# Altium schematic sheet Sheet1.SchDoc
size A4
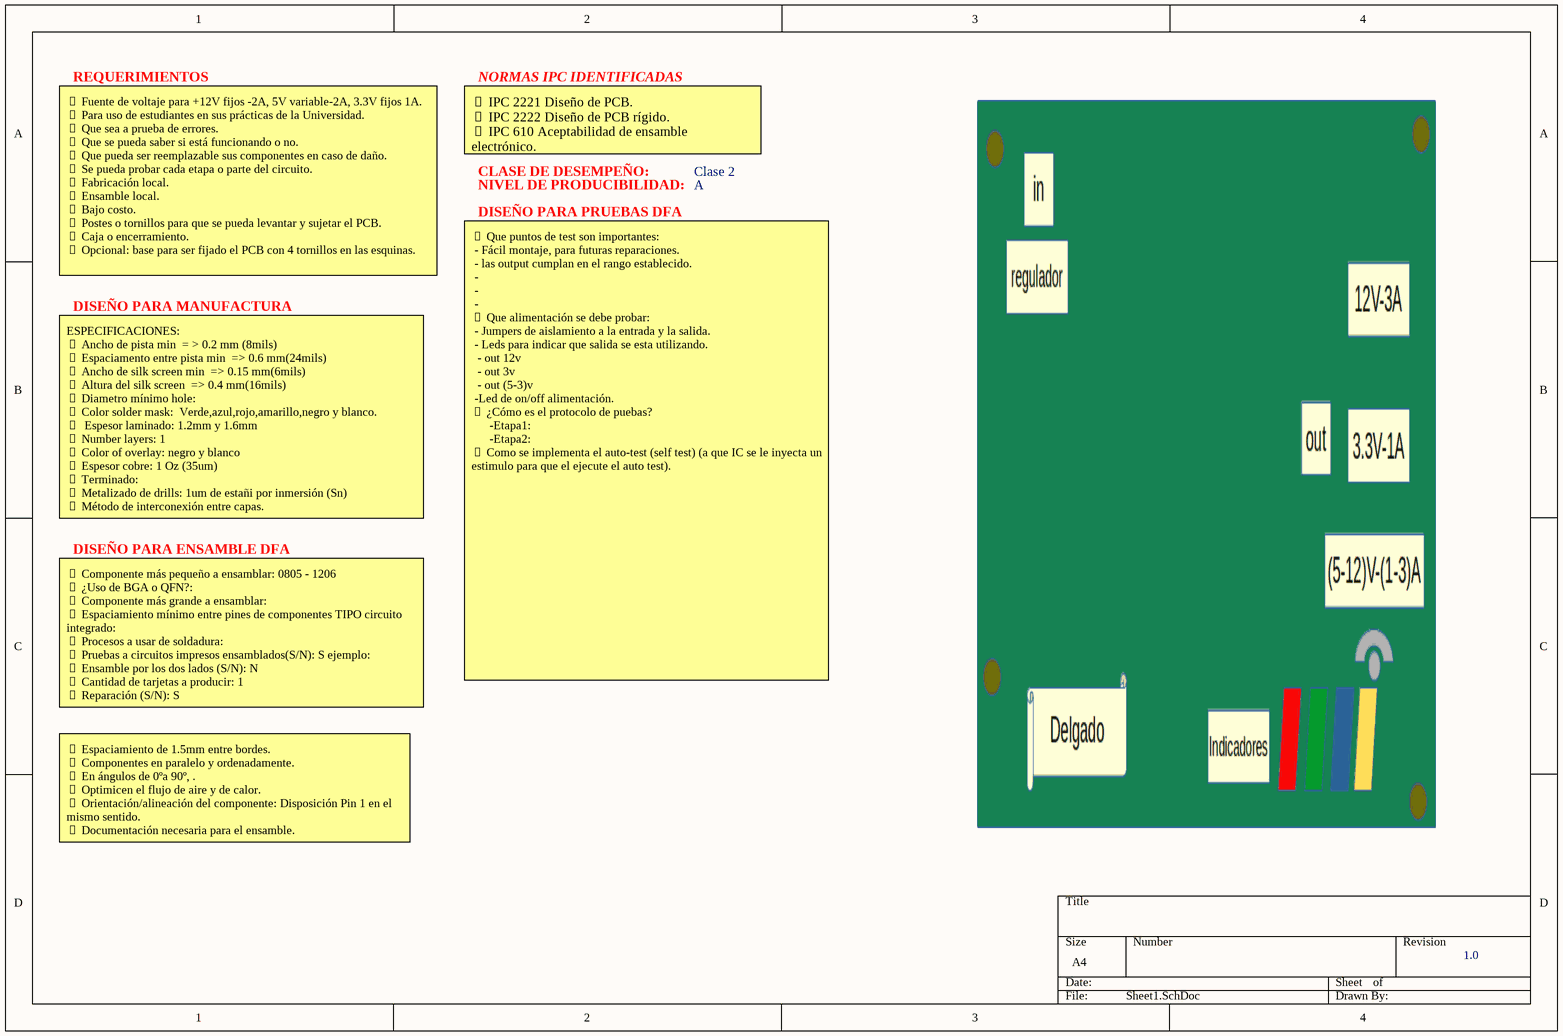
[diagram p0: Sheet1.SchDoc]

## Notes on the sheet
- REQUERIMIENTOS
- NORMAS IPC IDENTIFICADAS
-  IPC 2221 Diseño de PCB.
   IPC 2222 Diseño de PCB rígido.
   IPC 610 Aceptabilidad de ensamble electrónico.
- CLASE DE DESEMPEÑO:
- Clase 2
- NIVEL DE PRODUCIBILIDAD:
- DISEÑO PARA PRUEBAS DFA
- A
-  Fuente de voltaje para +12V fijos -2A, 5V variable-2A, 3.3V fijos 1A.
   Para uso de estudiantes en sus prácticas de la Universidad.
   Que sea a prueba de errores.
   Que se pueda saber si está funcionando o no.
   Que pueda ser reemplazable sus componentes en caso de daño.
   Se pueda probar cada etapa o parte del circuito.
   Fabricación local.
   Ensamble local.
   Bajo costo.
   Postes o tornillos para que se pueda levantar y sujetar el PCB.
   Caja o encerramiento.
   Opcional: base para ser fijado el PCB con 4 tornillos en las esquinas.
- DISEÑO PARA MANUFACTURA
- ESPECIFICACIONES:
   Ancho de pista min  = > 0.2 mm (8mils)
   Espaciamento entre pista min  => 0.6 mm(24mils)
   Ancho de silk screen min  => 0.15 mm(6mils)
   Altura del silk screen  => 0.4 mm(16mils)
   Diametro mínimo hole:
   Color solder mask:  Verde,azul,rojo,amarillo,negro y blanco.
    Espesor laminado: 1.2mm y 1.6mm
   Number layers: 1
   Color of overlay: negro y blanco
   Espesor cobre: 1 Oz (35um)
   Terminado:
   Metalizado de drills: 1um de estañi por inmersión (Sn)
   Método de interconexión entre capas.
- DISEÑO PARA ENSAMBLE DFA
-  Componente más pequeño a ensamblar: 0805 - 1206
   ¿Uso de BGA o QFN?:
   Componente más grande a ensamblar:
   Espaciamiento mínimo entre pines de componentes TIPO circuito integrado:
   Procesos a usar de soldadura:
   Pruebas a circuitos impresos ensamblados(S/N): S ejemplo:
   Ensamble por los dos lados (S/N): N
   Cantidad de tarjetas a producir: 1
   Reparación (S/N): S
-  Que puntos de test son importantes:
  - Fácil montaje, para futuras reparaciones.
  - las output cumplan en el rango establecido.
  -
  -
  -
   Que alimentación se debe probar:
  - Jumpers de aislamiento a la entrada y la salida.
  - Leds para indicar que salida se esta utilizando.
  - out 12v
  - out 3v
  - out (5-3)v
  -Led de on/off alimentación.
   ¿Cómo es el protocolo de puebas?
  -Etapa1:
  -Etapa2:
   Como se implementa el auto-test (self test) (a que IC se le inyecta un estimulo para que el ejecute el auto test).
-  Espaciamiento de 1.5mm entre bordes.
   Componentes en paralelo y ordenadamente.
   En ángulos de 0ºa 90º, .
   Optimicen el flujo de aire y de calor.
   Orientación/alineación del componente: Disposición Pin 1 en el mismo sentido.
   Documentación necesaria para el ensamble.
- 1.0